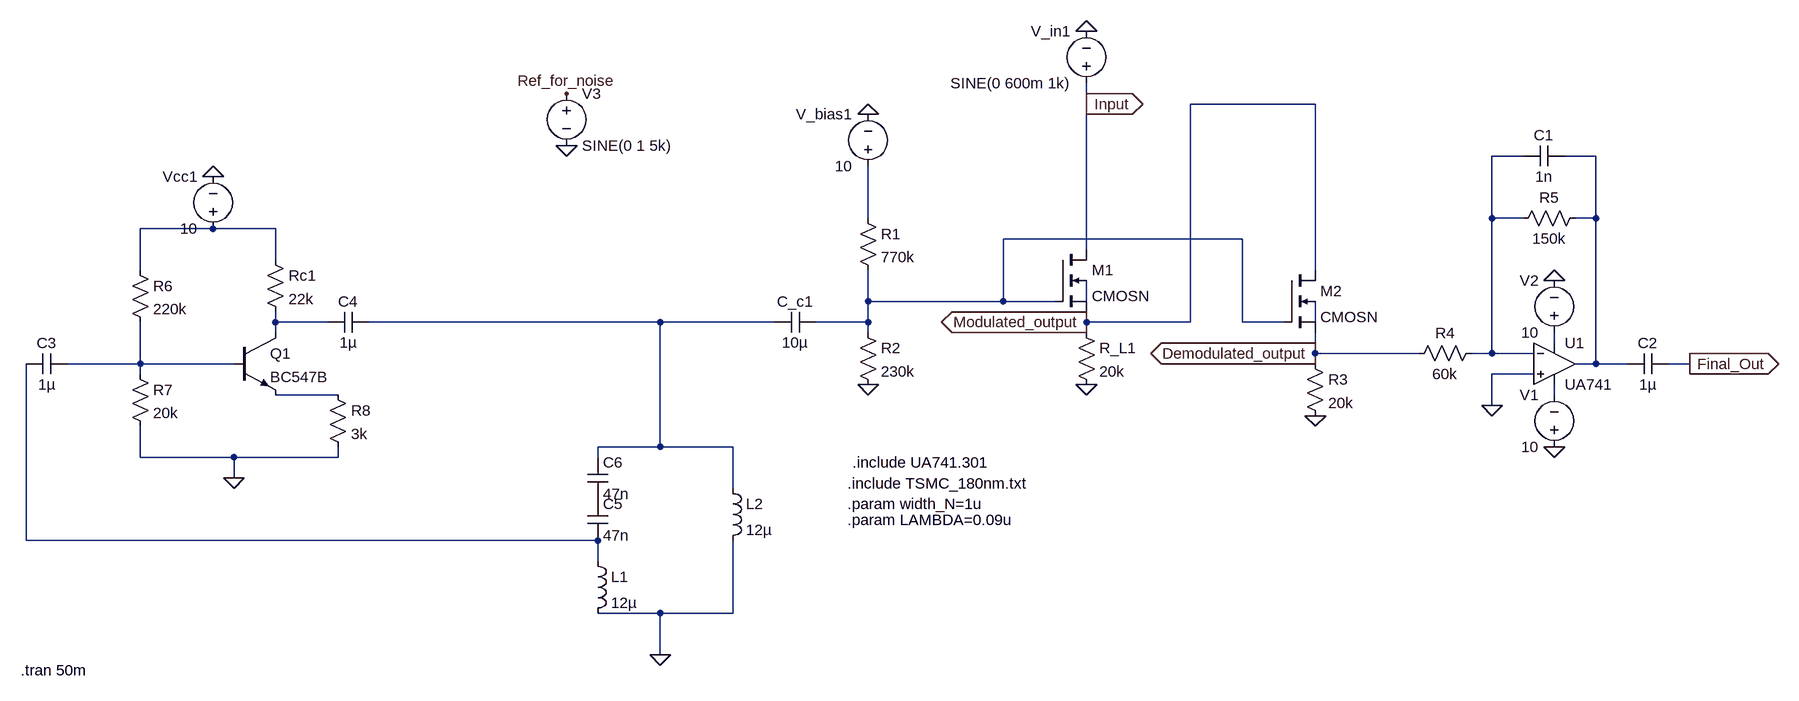
[diagram p0: schematic Hardware_sim.asc]
Hardware_sim.asc, the LTspice schematic file:
Version 4
SHEET 1 2156 760
WIRE 1056 -128 1056 -160
WIRE 1408 -128 1216 -128
WIRE 1728 -48 1680 -48
WIRE 1840 -48 1792 -48
WIRE 720 48 720 -32
WIRE 1680 48 1680 -48
WIRE 1728 48 1680 48
WIRE 1840 48 1840 -48
WIRE 1840 48 1808 48
WIRE -288 64 -400 64
WIRE -192 64 -288 64
WIRE 1296 80 928 80
WIRE 1056 96 1056 -128
WIRE -192 112 -192 64
WIRE -400 128 -400 64
WIRE 1408 128 1408 -128
WIRE 720 176 720 128
WIRE 928 176 928 80
WIRE 928 176 720 176
WIRE 1008 176 928 176
WIRE 1056 176 1056 144
WIRE -192 208 -192 192
WIRE -112 208 -192 208
WIRE 400 208 -48 208
WIRE 576 208 400 208
WIRE 720 208 720 176
WIRE 720 208 640 208
WIRE 1056 208 1056 192
WIRE 1216 208 1216 -128
WIRE 1216 208 1056 208
WIRE 1296 208 1296 80
WIRE 1360 208 1296 208
WIRE 1408 208 1408 176
WIRE -192 224 -192 208
WIRE 720 224 720 208
WIRE 1056 224 1056 208
WIRE 1776 240 1776 224
WIRE 1408 256 1408 224
WIRE 1568 256 1408 256
WIRE 1680 256 1680 48
WIRE 1680 256 1648 256
WIRE 1744 256 1680 256
WIRE -400 272 -400 208
WIRE -400 272 -512 272
WIRE -256 272 -400 272
WIRE 1408 272 1408 256
WIRE 1840 272 1840 48
WIRE 1840 272 1808 272
WIRE 1888 272 1840 272
WIRE 1984 272 1952 272
WIRE -400 288 -400 272
WIRE 1744 288 1680 288
WIRE -96 320 -192 320
WIRE 1776 320 1776 304
WIRE 1680 336 1680 288
WIRE 400 400 400 208
WIRE 400 400 304 400
WIRE 512 400 400 400
WIRE -400 416 -400 368
WIRE -256 416 -400 416
WIRE -96 416 -96 400
WIRE -96 416 -256 416
WIRE 304 416 304 400
WIRE -256 448 -256 416
WIRE 512 464 512 400
WIRE -576 544 -576 272
WIRE 304 544 -576 544
WIRE 304 576 304 544
WIRE 400 656 304 656
WIRE 512 656 512 544
WIRE 512 656 400 656
WIRE 400 720 400 656
FLAG 720 304 0
FLAG 720 -112 0
FLAG 1056 -240 0
FLAG 1056 304 0
FLAG 1408 352 0
FLAG 1776 400 0
FLAG 1776 144 0
FLAG 1056 -128 Input
IOPIN 1056 -128 Out
FLAG 1056 208 Modulated_output
IOPIN 1056 208 Out
FLAG 1984 272 Final_Out
IOPIN 1984 272 Out
FLAG 1408 256 Demodulated_output
IOPIN 1408 256 Out
FLAG 1680 336 0
FLAG 400 720 0
FLAG -256 448 0
FLAG -288 -16 0
FLAG 256 -64 0
FLAG 256 -144 Ref_for_noise
DATAFLAG 1056 64 ""
DATAFLAG 912 176 ""
DATAFLAG 1088 208 ""
DATAFLAG 1504 256 ""
DATAFLAG 1408 96 ""
SYMBOL nmos4 1008 96 R0
SYMATTR InstName M1
SYMATTR Value CMOSN
SYMATTR Value2 l={2*LAMBDA} w={width_N} ad={5*width_ N*LAMBDA} as={5*width_ N*LAMBDA} pd={10*LAMBDA+2*width_N} ps={10*LAMBDA+2*width_N}
SYMBOL res 704 32 R0
SYMATTR InstName R1
SYMATTR Value 770k
SYMBOL res 704 208 R0
SYMATTR InstName R2
SYMATTR Value 230k
SYMBOL cap 640 192 R90
WINDOW 0 0 32 VBottom 2
WINDOW 3 32 32 VTop 2
SYMATTR InstName C_c1
SYMATTR Value 10µ
SYMBOL voltage 720 -16 R180
WINDOW 0 24 96 Left 2
WINDOW 3 24 16 Left 2
SYMATTR InstName V_bias1
SYMATTR Value 10
SYMBOL voltage 1056 -144 R180
WINDOW 0 24 96 Left 2
WINDOW 3 24 16 Left 2
WINDOW 123 0 0 Left 0
WINDOW 39 0 0 Left 0
SYMATTR InstName V_in1
SYMATTR Value SINE(0 600m 1k)
SYMBOL res 1040 208 R0
SYMATTR InstName R_L1
SYMATTR Value 20k
SYMBOL nmos4 1360 128 R0
SYMATTR InstName M2
SYMATTR Value CMOSN
SYMATTR Value2 l={2*LAMBDA} w={width_N} ad={5*width_ N*LAMBDA} as={5*width_ N*LAMBDA} pd={10*LAMBDA+2*width_N} ps={10*LAMBDA+2*width_N}
SYMBOL res 1392 256 R0
SYMATTR InstName R3
SYMATTR Value 20k
SYMBOL OpAmps\\opamp2 1776 208 R0
SYMATTR InstName U1
SYMATTR Value UA741
SYMBOL voltage 1776 416 R180
WINDOW 0 24 96 Left 2
WINDOW 3 24 16 Left 2
WINDOW 123 0 0 Left 0
WINDOW 39 0 0 Left 0
SYMATTR InstName V1
SYMATTR Value 10
SYMBOL voltage 1776 240 R180
WINDOW 0 24 96 Left 2
WINDOW 3 24 16 Left 2
WINDOW 123 0 0 Left 0
WINDOW 39 0 0 Left 0
SYMATTR InstName V2
SYMATTR Value 10
SYMBOL res 1664 240 R90
WINDOW 0 0 56 VBottom 2
WINDOW 3 32 56 VTop 2
SYMATTR InstName R4
SYMATTR Value 60k
SYMBOL res 1824 32 R90
WINDOW 0 0 56 VBottom 2
WINDOW 3 32 56 VTop 2
SYMATTR InstName R5
SYMATTR Value 150k
SYMBOL cap 1792 -64 R90
WINDOW 0 0 32 VBottom 2
WINDOW 3 32 32 VTop 2
SYMATTR InstName C1
SYMATTR Value 1n
SYMBOL cap 1952 256 R90
WINDOW 0 0 32 VBottom 2
WINDOW 3 32 32 VTop 2
SYMATTR InstName C2
SYMATTR Value 1µ
SYMBOL ind 288 560 R0
SYMATTR InstName L1
SYMATTR Value 12µ
SYMBOL ind 496 448 R0
SYMATTR InstName L2
SYMATTR Value 12µ
SYMBOL voltage -288 80 R180
WINDOW 0 24 96 Left 2
WINDOW 3 24 16 Left 2
WINDOW 123 0 0 Left 0
WINDOW 39 0 0 Left 0
SYMATTR InstName Vcc1
SYMATTR Value 10
SYMBOL res -416 112 R0
SYMATTR InstName R6
SYMATTR Value 220k
SYMBOL res -208 96 R0
SYMATTR InstName Rc1
SYMATTR Value 22k
SYMBOL res -416 272 R0
SYMATTR InstName R7
SYMATTR Value 20k
SYMBOL npn -256 224 R0
SYMATTR InstName Q1
SYMATTR Value BC547B
SYMBOL cap -512 256 R90
WINDOW 0 0 32 VBottom 2
WINDOW 3 32 32 VTop 2
SYMATTR InstName C3
SYMATTR Value 1µ
SYMBOL cap -48 192 R90
WINDOW 0 0 32 VBottom 2
WINDOW 3 32 32 VTop 2
SYMATTR InstName C4
SYMATTR Value 1µ
SYMBOL res -112 304 R0
SYMATTR InstName R8
SYMATTR Value 3k
SYMBOL cap 288 480 R0
SYMATTR InstName C5
SYMATTR Value 47n
SYMBOL cap 288 416 R0
SYMATTR InstName C6
SYMATTR Value 47n
SYMBOL voltage 256 -160 R0
WINDOW 123 0 0 Left 0
WINDOW 39 0 0 Left 0
SYMATTR InstName V3
SYMATTR Value SINE(0 1 5k)
TEXT 688 456 Left 2 !.include TSMC_180nm.txt
TEXT 688 488 Left 2 !.param width_N=1u
TEXT 688 512 Left 2 !.param LAMBDA=0.09u
TEXT 696 424 Left 2 !.include UA741.301
TEXT -584 744 Left 2 !.tran 50m

The netlist it stands for:
* Hardware_sim.asc
M1 Input N005 Modulated_output N006 CMOSN l={2*LAMBDA} w={width_N} ad={5*width_ N*LAMBDA} as={5*width_ N*LAMBDA} pd={10*LAMBDA+2*width_N} ps={10*LAMBDA+2*width_N}
R1 N003 N005 770k
R2 N005 0 230k
C_c1 N005 N008 10µ
V_bias1 N003 0 10
V_in1 Input 0 SINE(0 600m 1k)
R_L1 Modulated_output 0 20k
M2 Modulated_output N005 Demodulated_output N009 CMOSN l={2*LAMBDA} w={width_N} ad={5*width_ N*LAMBDA} as={5*width_ N*LAMBDA} pd={10*LAMBDA+2*width_N} ps={10*LAMBDA+2*width_N}
R3 Demodulated_output 0 20k
XU1 0 N001 N010 N013 N002 UA741  ; pins In+ In- V+ V- OUT
V1 0 N013 10
V2 N010 0 10
R4 N001 Demodulated_output 60k
R5 N002 N001 150k
C1 N002 N001 1n
C2 Final_Out N002 1µ
L1 N014 0 12µ
L2 N008 0 12µ
Vcc1 N004 0 10
R6 N004 N011 220k
Rc1 N004 N007 22k
R7 N011 0 20k
Q1 N007 N011 N012 0 BC547B
C3 N011 N014 1µ
C4 N008 N007 1µ
R8 N012 0 3k
C5 P001 N014 47n
C6 N008 P001 47n
V3 Ref_for_noise 0 SINE(0 1 5k)
.model NPN NPN
.model PNP PNP
.lib standard.bjt
.model NMOS NMOS
.model PMOS PMOS
.lib standard.mos
.include TSMC_180nm.txt
.param width_N=1u
.param LAMBDA=0.09u
.include UA741.301
.tran 50m
.backanno
.end